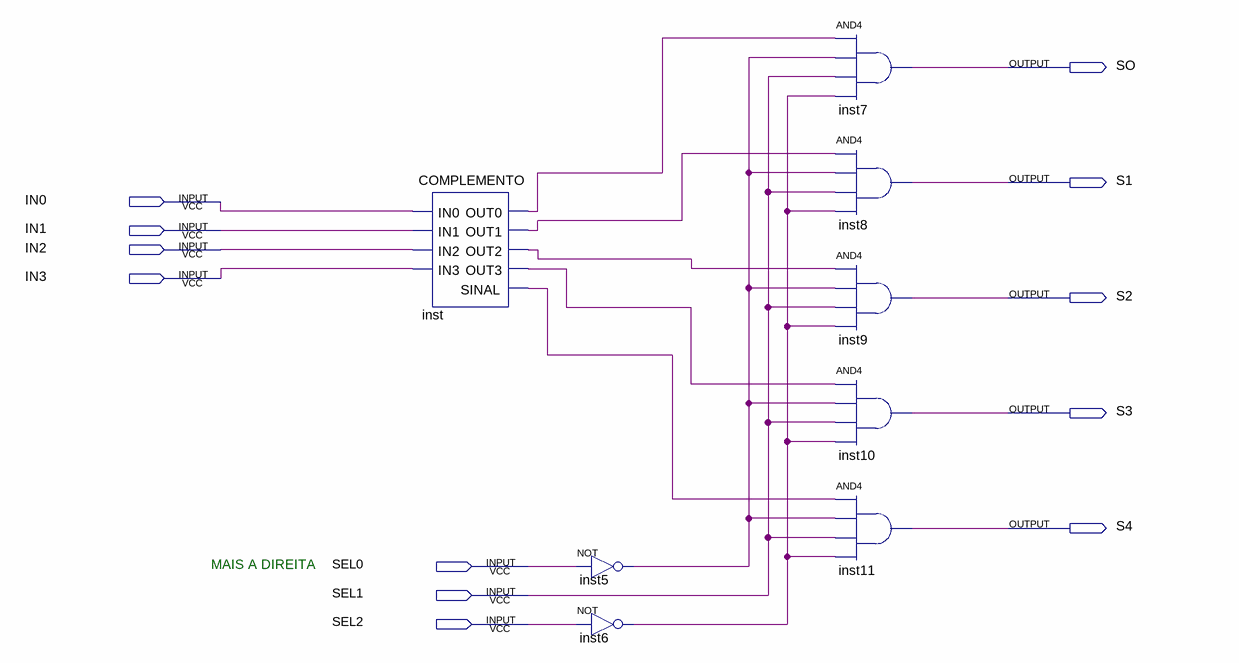
[diagram p0: schematic sheet]
// Quartus schematic COMPLEMENTOdeB.bdf as structural Verilog: 8 symbols, 12 pins
module COMPLEMENTOdeB (
  input  IN0,
  input  IN1,
  input  IN2,
  input  IN3,
  input  SEL0,
  input  SEL1,
  input  SEL2,
  output SO,
  output S1,
  output S2,
  output S3,
  output S4
);

  wire inst5_out, inst6_out, inst_out0, inst_out1, inst_out2, inst_out3, inst_sinal;

  COMPLEMENTO inst (
    .IN0(IN0), .IN1(IN1), .IN2(IN2), .IN3(IN3), .OUT0(inst_out0), .OUT1(inst_out1), .OUT2(inst_out2),
    .OUT3(inst_out3), .SINAL(inst_sinal));
  not inst5 (inst5_out, SEL0);
  not inst6 (inst6_out, SEL2);
  and inst7 (SO, inst_out0, inst5_out, SEL1, inst6_out);
  and inst8 (S1, inst_out1, inst5_out, SEL1, inst6_out);
  and inst9 (S2, inst_out2, inst5_out, SEL1, inst6_out);
  and inst10 (S3, inst_out3, inst5_out, SEL1, inst6_out);
  and inst11 (S4, inst_sinal, inst5_out, SEL1, inst6_out);

  // Notes on the sheet:
  //   MAIS A DIREITA
endmodule
